# Altium schematic sheet ZYNQ-Connecters.SchDoc
size A3; DrawnBy: WwWangGuan; SheetNumber: 9; SheetTotal: 9
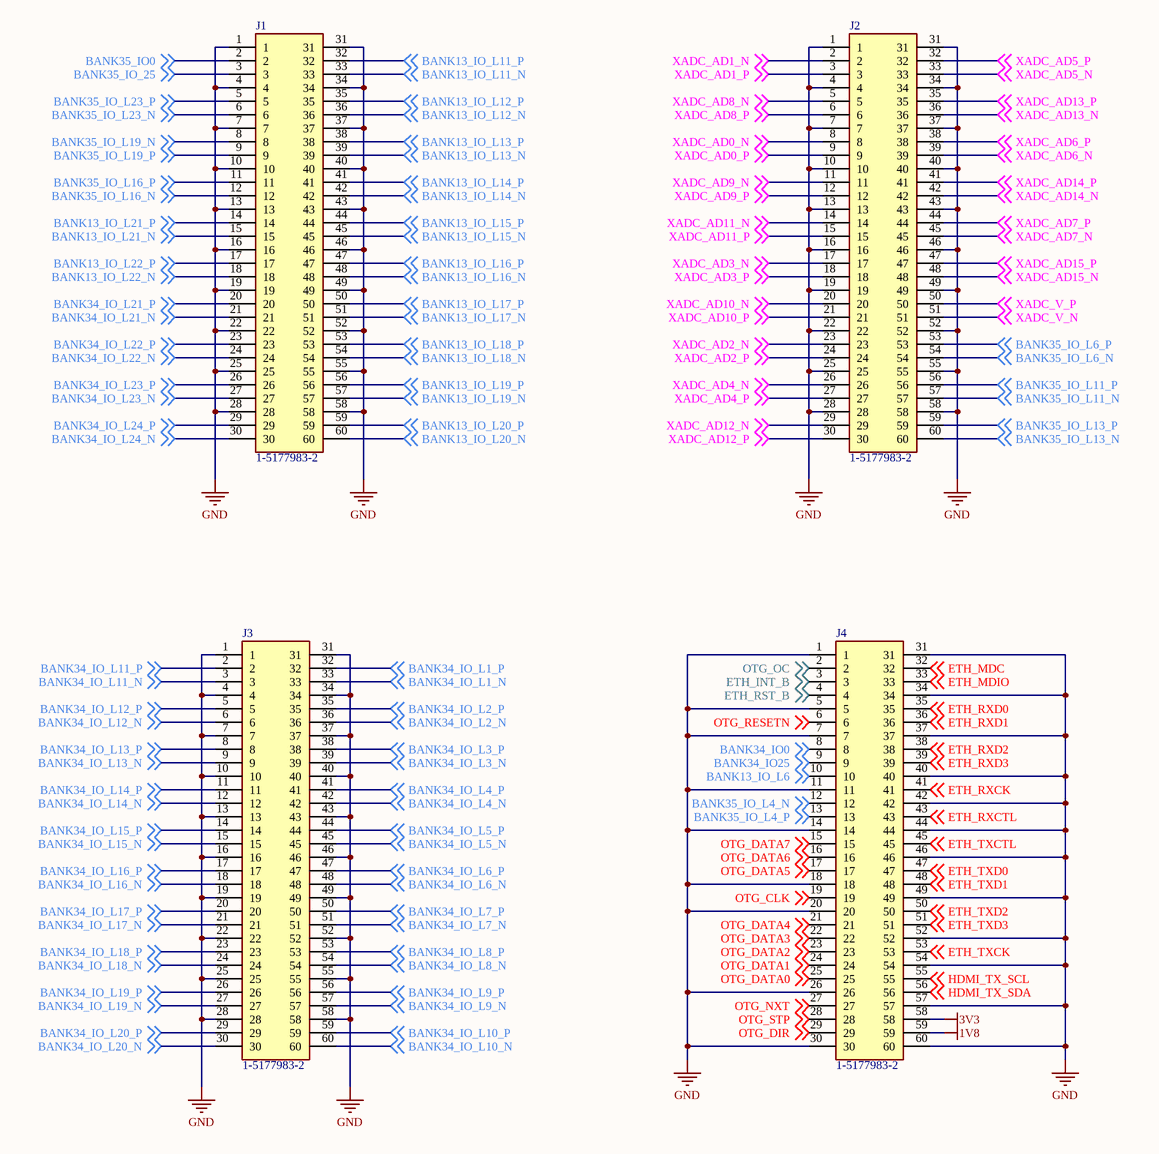
[diagram p0: ZYNQ-Connecters.SchDoc]

## Parts
J1  1-5177983-2  [5177983-2]
J2  1-5177983-2  [5177983-2]
J3  1-5177983-2  [5177983-2]
J4  1-5177983-2  [5177983-2]

## Nets
1V8: J4.59
3V3: J4.58
GND: J1.1 J1.4 J1.7 J1.10 J1.13 J1.16 J1.19 J1.22 J1.25 J1.28 J1.31 J1.34 J1.37 J1.40 J1.43 J1.46 J1.49 J1.52 J1.55 J1.58 J2.1 J2.4 J2.7 J2.10 J2.13 J2.16 J2.19 J2.22 J2.25 J2.28 J2.31 J2.34 J2.37 J2.40 J2.43 J2.46 J2.49 J2.52 J2.55 J2.58 J3.1 J3.4 J3.7 J3.10 J3.13 J3.16 J3.19 J3.22 J3.25 J3.28 J3.31 J3.34 J3.37 J3.40 J3.43 J3.46 J3.49 J3.52 J3.55 J3.58 J4.1 J4.5 J4.7 J4.11 J4.14 J4.18 J4.20 J4.26 J4.30 J4.31 J4.34 J4.37 J4.40 J4.42 J4.44 J4.46 J4.49 J4.52 J4.54 J4.57 J4.60
BANK13_IO_L6: J4.10 ; off-sheet BANK13_IO_L6
BANK13_IO_L11_N: J1.33 ; off-sheet BANK13_IO_L11_N
BANK13_IO_L11_P: J1.32 ; off-sheet BANK13_IO_L11_P
BANK13_IO_L12_N: J1.36 ; off-sheet BANK13_IO_L12_N
BANK13_IO_L12_P: J1.35 ; off-sheet BANK13_IO_L12_P
BANK13_IO_L13_N: J1.39 ; off-sheet BANK13_IO_L13_N
BANK13_IO_L13_P: J1.38 ; off-sheet BANK13_IO_L13_P
BANK13_IO_L14_N: J1.42 ; off-sheet BANK13_IO_L14_N
BANK13_IO_L14_P: J1.41 ; off-sheet BANK13_IO_L14_P
BANK13_IO_L15_N: J1.45 ; off-sheet BANK13_IO_L15_N
BANK13_IO_L15_P: J1.44 ; off-sheet BANK13_IO_L15_P
BANK13_IO_L16_N: J1.48 ; off-sheet BANK13_IO_L16_N
BANK13_IO_L16_P: J1.47 ; off-sheet BANK13_IO_L16_P
BANK13_IO_L17_N: J1.51 ; off-sheet BANK13_IO_L17_N
BANK13_IO_L17_P: J1.50 ; off-sheet BANK13_IO_L17_P
BANK13_IO_L18_N: J1.54 ; off-sheet BANK13_IO_L18_N
BANK13_IO_L18_P: J1.53 ; off-sheet BANK13_IO_L18_P
BANK13_IO_L19_N: J1.57 ; off-sheet BANK13_IO_L19_N
BANK13_IO_L19_P: J1.56 ; off-sheet BANK13_IO_L19_P
BANK13_IO_L20_N: J1.60 ; off-sheet BANK13_IO_L20_N
BANK13_IO_L20_P: J1.59 ; off-sheet BANK13_IO_L20_P
BANK13_IO_L21_N: J1.15 ; off-sheet BANK13_IO_L21_N
BANK13_IO_L21_P: J1.14 ; off-sheet BANK13_IO_L21_P
BANK13_IO_L22_N: J1.18 ; off-sheet BANK13_IO_L22_N
BANK13_IO_L22_P: J1.17 ; off-sheet BANK13_IO_L22_P
BANK34_IO0: J4.8 ; off-sheet BANK34_IO0
BANK34_IO25: J4.9 ; off-sheet BANK34_IO25
BANK34_IO_L1_N: J3.33 ; off-sheet BANK34_IO_L1_N
BANK34_IO_L1_P: J3.32 ; off-sheet BANK34_IO_L1_P
BANK34_IO_L2_N: J3.36 ; off-sheet BANK34_IO_L2_N
BANK34_IO_L2_P: J3.35 ; off-sheet BANK34_IO_L2_P
BANK34_IO_L3_N: J3.39 ; off-sheet BANK34_IO_L3_N
BANK34_IO_L3_P: J3.38 ; off-sheet BANK34_IO_L3_P
BANK34_IO_L4_N: J3.42 ; off-sheet BANK34_IO_L4_N
BANK34_IO_L4_P: J3.41 ; off-sheet BANK34_IO_L4_P
BANK34_IO_L5_N: J3.45 ; off-sheet BANK34_IO_L5_N
BANK34_IO_L5_P: J3.44 ; off-sheet BANK34_IO_L5_P
BANK34_IO_L6_N: J3.48 ; off-sheet BANK34_IO_L6_N
BANK34_IO_L6_P: J3.47 ; off-sheet BANK34_IO_L6_P
BANK34_IO_L7_N: J3.51 ; off-sheet BANK34_IO_L7_N
BANK34_IO_L7_P: J3.50 ; off-sheet BANK34_IO_L7_P
BANK34_IO_L8_N: J3.54 ; off-sheet BANK34_IO_L8_N
BANK34_IO_L8_P: J3.53 ; off-sheet BANK34_IO_L8_P
BANK34_IO_L9_N: J3.57 ; off-sheet BANK34_IO_L9_N
BANK34_IO_L9_P: J3.56 ; off-sheet BANK34_IO_L9_P
BANK34_IO_L10_N: J3.60 ; off-sheet BANK34_IO_L10_N
BANK34_IO_L10_P: J3.59 ; off-sheet BANK34_IO_L10_P
BANK34_IO_L11_N: J3.3 ; off-sheet BANK34_IO_L11_N
BANK34_IO_L11_P: J3.2 ; off-sheet BANK34_IO_L11_P
BANK34_IO_L12_N: J3.6 ; off-sheet BANK34_IO_L12_N
BANK34_IO_L12_P: J3.5 ; off-sheet BANK34_IO_L12_P
BANK34_IO_L13_N: J3.9 ; off-sheet BANK34_IO_L13_N
BANK34_IO_L13_P: J3.8 ; off-sheet BANK34_IO_L13_P
BANK34_IO_L14_N: J3.12 ; off-sheet BANK34_IO_L14_N
BANK34_IO_L14_P: J3.11 ; off-sheet BANK34_IO_L14_P
BANK34_IO_L15_N: J3.15 ; off-sheet BANK34_IO_L15_N
BANK34_IO_L15_P: J3.14 ; off-sheet BANK34_IO_L15_P
BANK34_IO_L16_N: J3.18 ; off-sheet BANK34_IO_L16_N
BANK34_IO_L16_P: J3.17 ; off-sheet BANK34_IO_L16_P
BANK34_IO_L17_N: J3.21 ; off-sheet BANK34_IO_L17_N
BANK34_IO_L17_P: J3.20 ; off-sheet BANK34_IO_L17_P
BANK34_IO_L18_N: J3.24 ; off-sheet BANK34_IO_L18_N
BANK34_IO_L18_P: J3.23 ; off-sheet BANK34_IO_L18_P
BANK34_IO_L19_N: J3.27 ; off-sheet BANK34_IO_L19_N
BANK34_IO_L19_P: J3.26 ; off-sheet BANK34_IO_L19_P
BANK34_IO_L20_N: J3.30 ; off-sheet BANK34_IO_L20_N
BANK34_IO_L20_P: J3.29 ; off-sheet BANK34_IO_L20_P
BANK34_IO_L21_N: J1.21 ; off-sheet BANK34_IO_L21_N
BANK34_IO_L21_P: J1.20 ; off-sheet BANK34_IO_L21_P
BANK34_IO_L22_N: J1.24 ; off-sheet BANK34_IO_L22_N
BANK34_IO_L22_P: J1.23 ; off-sheet BANK34_IO_L22_P
BANK34_IO_L23_N: J1.27 ; off-sheet BANK34_IO_L23_N
BANK34_IO_L23_P: J1.26 ; off-sheet BANK34_IO_L23_P
BANK34_IO_L24_N: J1.30 ; off-sheet BANK34_IO_L24_N
BANK34_IO_L24_P: J1.29 ; off-sheet BANK34_IO_L24_P
BANK35_IO0: J1.2 ; off-sheet BANK35_IO0
BANK35_IO_25: J1.3 ; off-sheet BANK35_IO_25
BANK35_IO_L4_N: J4.12 ; off-sheet BANK35_IO_L4_N
BANK35_IO_L4_P: J4.13 ; off-sheet BANK35_IO_L4_P
BANK35_IO_L6_N: J2.54 ; off-sheet BANK35_IO_L6_N
BANK35_IO_L6_P: J2.53 ; off-sheet BANK35_IO_L6_P
BANK35_IO_L11_N: J2.57 ; off-sheet BANK35_IO_L11_N
BANK35_IO_L11_P: J2.56 ; off-sheet BANK35_IO_L11_P
BANK35_IO_L13_N: J2.60 ; off-sheet BANK35_IO_L13_N
BANK35_IO_L13_P: J2.59 ; off-sheet BANK35_IO_L13_P
BANK35_IO_L16_N: J1.12 ; off-sheet BANK35_IO_L16_N
BANK35_IO_L16_P: J1.11 ; off-sheet BANK35_IO_L16_P
BANK35_IO_L19_N: J1.8 ; off-sheet BANK35_IO_L19_N
BANK35_IO_L19_P: J1.9 ; off-sheet BANK35_IO_L19_P
BANK35_IO_L23_N: J1.6 ; off-sheet BANK35_IO_L23_N
BANK35_IO_L23_P: J1.5 ; off-sheet BANK35_IO_L23_P
ETH_INT_B: J4.3 ; off-sheet ETH_INT_B
ETH_MDC: J4.32 ; off-sheet ETH_MDC
ETH_MDIO: J4.33 ; off-sheet ETH_MDIO
ETH_RST_B: J4.4 ; off-sheet ETH_RST_B
ETH_RXCK: J4.41 ; off-sheet ETH_RXCK
ETH_RXCTL: J4.43 ; off-sheet ETH_RXCTL
ETH_RXD0: J4.35 ; off-sheet ETH_RXD0
ETH_RXD1: J4.36 ; off-sheet ETH_RXD1
ETH_RXD2: J4.38 ; off-sheet ETH_RXD2
ETH_RXD3: J4.39 ; off-sheet ETH_RXD3
ETH_TXCK: J4.53 ; off-sheet ETH_TXCK
ETH_TXCTL: J4.45 ; off-sheet ETH_TXCTL
ETH_TXD0: J4.47 ; off-sheet ETH_TXD0
ETH_TXD1: J4.48 ; off-sheet ETH_TXD1
ETH_TXD2: J4.50 ; off-sheet ETH_TXD2
ETH_TXD3: J4.51 ; off-sheet ETH_TXD3
HDMI_TX_SCL: J4.55 ; off-sheet HDMI_TX_SCL
HDMI_TX_SDA: J4.56 ; off-sheet HDMI_TX_SDA
OTG_CLK: J4.19 ; off-sheet OTG_CLK
OTG_DATA0: J4.25 ; off-sheet OTG_DATA0
OTG_DATA1: J4.24 ; off-sheet OTG_DATA1
OTG_DATA2: J4.23 ; off-sheet OTG_DATA2
OTG_DATA3: J4.22 ; off-sheet OTG_DATA3
OTG_DATA4: J4.21 ; off-sheet OTG_DATA4
OTG_DATA5: J4.17 ; off-sheet OTG_DATA5
OTG_DATA6: J4.16 ; off-sheet OTG_DATA6
OTG_DATA7: J4.15 ; off-sheet OTG_DATA7
OTG_DIR: J4.29 ; off-sheet OTG_DIR
OTG_NXT: J4.27 ; off-sheet OTG_NXT
OTG_OC: J4.2 ; off-sheet OTG_OC
OTG_RESETN: J4.6 ; off-sheet OTG_RESETN
OTG_STP: J4.28 ; off-sheet OTG_STP
XADC_AD0_N: J2.8 ; off-sheet XADC_AD0_N
XADC_AD0_P: J2.9 ; off-sheet XADC_AD0_P
XADC_AD1_N: J2.2 ; off-sheet XADC_AD1_N
XADC_AD1_P: J2.3 ; off-sheet XADC_AD1_P
XADC_AD2_N: J2.23 ; off-sheet XADC_AD2_N
XADC_AD2_P: J2.24 ; off-sheet XADC_AD2_P
XADC_AD3_N: J2.17 ; off-sheet XADC_AD3_N
XADC_AD3_P: J2.18 ; off-sheet XADC_AD3_P
XADC_AD4_N: J2.26 ; off-sheet XADC_AD4_N
XADC_AD4_P: J2.27 ; off-sheet XADC_AD4_P
XADC_AD5_N: J2.33 ; off-sheet XADC_AD5_N
XADC_AD5_P: J2.32 ; off-sheet XADC_AD5_P
XADC_AD6_N: J2.39 ; off-sheet XADC_AD6_N
XADC_AD6_P: J2.38 ; off-sheet XADC_AD6_P
XADC_AD7_N: J2.45 ; off-sheet XADC_AD7_N
XADC_AD7_P: J2.44 ; off-sheet XADC_AD7_P
XADC_AD8_N: J2.5 ; off-sheet XADC_AD8_N
XADC_AD8_P: J2.6 ; off-sheet XADC_AD8_P
XADC_AD9_N: J2.11 ; off-sheet XADC_AD9_N
XADC_AD9_P: J2.12 ; off-sheet XADC_AD9_P
XADC_AD10_N: J2.20 ; off-sheet XADC_AD10_N
XADC_AD10_P: J2.21 ; off-sheet XADC_AD10_P
XADC_AD11_N: J2.14 ; off-sheet XADC_AD11_N
XADC_AD11_P: J2.15 ; off-sheet XADC_AD11_P
XADC_AD12_N: J2.29 ; off-sheet XADC_AD12_N
XADC_AD12_P: J2.30 ; off-sheet XADC_AD12_P
XADC_AD13_N: J2.36 ; off-sheet XADC_AD13_N
XADC_AD13_P: J2.35 ; off-sheet XADC_AD13_P
XADC_AD14_N: J2.42 ; off-sheet XADC_AD14_N
XADC_AD14_P: J2.41 ; off-sheet XADC_AD14_P
XADC_AD15_N: J2.48 ; off-sheet XADC_AD15_N
XADC_AD15_P: J2.47 ; off-sheet XADC_AD15_P
XADC_V_N: J2.51 ; off-sheet XADC_V_N
XADC_V_P: J2.50 ; off-sheet XADC_V_P

## Library data of the parts
J1-J4 = 1-5177983-2: Connector; Manufacturer_Name: TE Connectivity; Datasheet Link: http://www.te.com/commerce/DocumentDelivery/DDEController?Action=srchrtrv&DocNm=5177983&DocType=Customer+Drawing&DocLang=English; Manufacturer_Part_Number: 1-5177983-2; Mouser Part Number: 571-1-5177983-2; Mouser Price/Stock: https://www.mouser.co.uk/ProductDetail/TE-Connectivity-AMP/1-5177983-2?qs=Xjc0wECptJC2XPkGv1w1ig%3D%3D; Arrow Part Number: 1-5177983-2; Arrow Price/Stock: https://www.arrow.com/en/products/1-5177983-2/te-connectivity